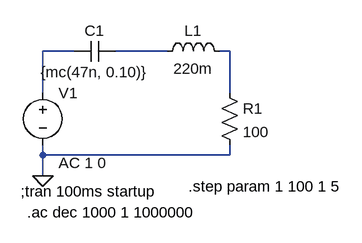
[diagram p0: schematic lab4.asc]
lab4.asc, the LTspice schematic file:
Version 4
SHEET 1 968 680
WIRE 272 96 224 96
WIRE 416 96 336 96
WIRE 512 96 496 96
WIRE 224 160 224 96
WIRE 512 160 512 96
WIRE 224 256 224 240
WIRE 512 256 512 240
WIRE 512 256 224 256
WIRE 224 288 224 256
FLAG 224 288 0
SYMBOL voltage 224 144 R0
WINDOW 123 24 124 Left 2
WINDOW 39 0 0 Left 0
SYMATTR InstName V1
SYMATTR Value ""
SYMATTR Value2 AC 1 0
SYMBOL res 496 144 R0
SYMATTR InstName R1
SYMATTR Value 100
SYMBOL cap 336 80 R90
WINDOW 0 0 32 VBottom 2
WINDOW 3 32 32 VTop 2
SYMATTR InstName C1
SYMATTR Value {mc(47n, 0.10)}
SYMBOL ind 400 112 R270
WINDOW 0 32 56 VTop 2
WINDOW 3 5 56 VBottom 2
SYMATTR InstName L1
SYMATTR Value 220m
TEXT 190 312 Left 2 !;tran 100ms startup
TEXT 448 304 Left 2 !.step param 1 100 1 5
TEXT 200 344 Left 2 !.ac dec 1000 1 1000000

The netlist it stands for:
* lab4.asc
V1 N001 0 AC 1 0
R1 N003 0 100
C1 N002 N001 {mc(47n, 0.10)}
L1 N002 N003 220m
;tran 100ms startup
.step param 1 100 1 5
.ac dec 1000 1 1000000
.backanno
.end